# Altium schematic sheet Main.SchDoc
size A
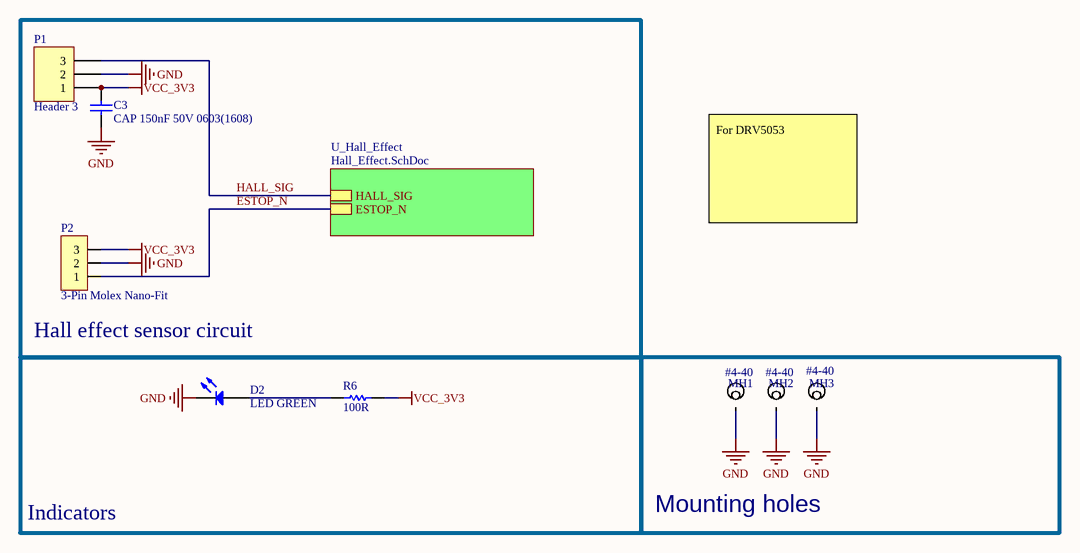
[diagram p0: Main.SchDoc]

## Parts
C3  CAP 150nF 50V 0603(1608)  [CAPC0603(1608)100_M]
D2  LED GREEN  [LED_0805]
MH1  #4-40  [Mounting Hole #4-40]
MH2  #4-40  [Mounting Hole #4-40]
MH3  #4-40  [Mounting Hole #4-40]
P1  Header 3  [HDR1X3]
P2  3-Pin Molex Nano-Fit  [MOLEX NANO-FIT 1X3]
R6  100R  [RESC0603(1608)_N]

## Blocks framed on the sheet
Hall effect sensor circuit: C3 P1 P2
Mounting holes: MH1-MH3

## Sub-sheets
U_Hall_Effect = Hall_Effect.SchDoc: ESTOP_N, HALL_SIG

## Nets
GND: C3.2 D2.1(K) MH1.0 MH2.0 MH3.0 P1.2 P2.2
VCC_3V3: C3.1 P1.1 P2.3 R6.2
ESTOP_N: P2.1 ; sheet U_Hall_Effect/ESTOP_N
HALL_SIG: P1.3 ; sheet U_Hall_Effect/HALL_SIG
NetD2_2: D2.2(A) R6.1

## Notes on the sheet
- For DRV5053
- Indicators

## Library data of the parts
C3 = CMP-1035-02624-1: CAP 150nF 50V -20% to +80% 0603 (1608 Metric) Thickness 1mm SMD; Case-Metric: 1608; Case-EIA: 0603; Max Thickness: 1 mm; Value: 150nF; Tolerance: -20% to +80%; Technology: SMT; Rated Voltage: 50 V
D2 = LED0: led; Manufacturer: Lite-On Inc.; Manufacturer Part Number: LTST-C171KGKT; Lens Color: Colorless; Lens Transparency: Clear; Millicandela Rating: 35mcd; Lens Style/Size: Rectangle with Flat Top, 1.40mm x 1.25mm; Voltage - Forward (Vf) (Typ): 2V; Current - Test: 20mA; Viewing Angle: 130°; Wavelength - Dominant: 571nm; Wavelength - Peak: 574nm; Supplier 1: Digi-Key; Supplier Part Number 1: 160-1426-1-ND; RoHS: RoHS Compliant; Category: Optoelectronics; Stock 1: 350441; Pricing 1: 1=0.31, 10=0.225, 25=0.1656, 100=0.1183, 250=0.0804, 500=0.07096, 1000=0.05558 (USD); Packaging: Cut Tape (CT); Part Status: Active; Color: Green; Mounting Type: Surface Mount; Features: -; Package / Case: 0805 (2012 Metric); Size / Dimension: 2.00mm L x 1.25mm W; Height (Max): 0.90mm; ComponentLink1URL: http://optoelectronics.liteon.com/upload/download/DS22-2000-118/LTST-C171KGKT.pdf; ComponentLink1Description: http://optoelectronics.liteon.com/upload/download/DS22-2000-118/LTST-C171KGKT.pdf
MH1-MH3 = Mounting Hole #4-40, Loose Fit: Mounting Hole for ANSI #4-40 w/ Flat Washer, Loose Fit; Datasheet: http://blogs.mentor.com/tom-hausherr/blog/tag/pcb-mounting-holes/
P1 = Header 3: Header, 3-Pin; LatestRevisionDate: 17-Jul-2002; LatestRevisionNote: Re-released for DXP Platform.; Publisher: Altium Limited
P2 = 3-Pin Nano-Fit: NanoFit RA Hdr TH SR 3Ckt; Part Number: 105313-1204; Supplier: Mouser; Manufacturer: Molex; Supplier Part Number: 538-105313-1204
R6 = CMP-1012-00050-1: 100R 0.1W 5% 0603 (1608 Metric)  SMD; Case-EIA: 0603; Value: 100.00 Ohm; Case-Metric: 1608; Tolerance: 5 %; Technology: SMT; Power: 0.1 W